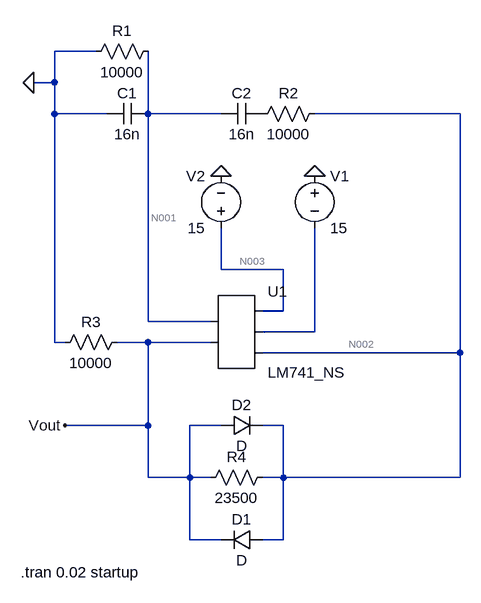
[diagram p0: schematic ee18btech11049.asc]
* ee18btech11049.asc
* U1: LM741_NS (symbol AutoGenerated\LM741_NS not available, pins judged from their places): pin1=N001 pin2=Vout pin3=N003 pin4=N004 pin5=N002
C1 N001 0 16n
R1 N001 0 10000
C2 P001 N001 16n
R2 N002 P001 10000
V1 0 N004 15
V2 N003 0 15
R3 Vout 0 10000
R4 N002 Vout 23500
D1 N002 Vout D
D2 Vout N002 D
.model D D
.lib standard.dio
.tran 0.02 startup
.backanno
.end

* Results of the author's LTspice run, read from the files saved beside the schematic
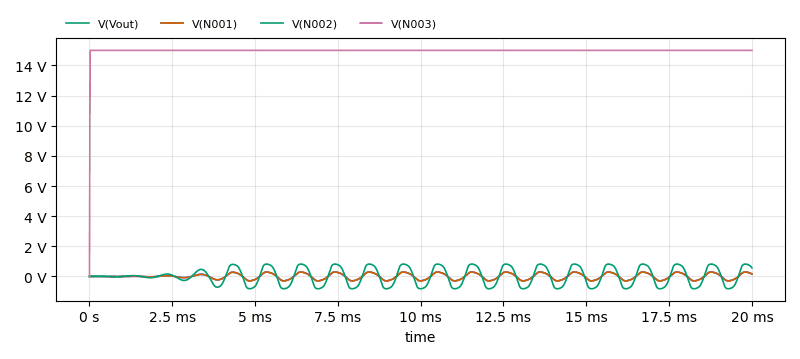
[diagram p1: Transient Analysis of ee18btech11049.asc, plotted from the saved traces]
* Transient Analysis, 1 run:
*   V(Vout): min -294.1 mV, max 294.3 mV, average 2.386 mV, rms 188.9 mV, last 169.3 mV
*   V(N001): min -295.1 mV, max 293.3 mV, average 1.391 mV, rms 188.9 mV, last 167.7 mV
*   V(N002): min -820.6 mV, max 821.4 mV, average 8.524 mV, rms 570 mV, last 568.3 mV
*   V(N003): min 0 V, max 15 V, average 14.99 V, rms 15 V, last 15 V